# Altium schematic sheet SAM_E54_Xplained_Pro_triple_input_power_supply_HSW.SchDoc: Power supply
size A3; Organization: Microchip Norway; Address1: Vestre Rosten 79; Address2: N-7075 TILLER; Address3: NORWAY; DocumentNumber: A09-2748; Revision: 5; SheetNumber: 2; SheetTotal: 13; DrawnBy: Microchip Norway; Engineer: HN; PageSetup: Record=PageOptions|CenterHorizontal=True|CenterVertical=True|PrintScale=1.01|XCorrection=1.00|YCorrection=1.00|PrintKind=1|BorderSize=5000000|LeftOffset=0|BottomOffset=0|Orientation=2|PaperLength=1000|PaperWidth=1000|Scale=100|PaperSource=7|PrintQuality=-4|MediaType=1|DitherType=10|PaperKind=A3 (297 x 420 mm)|PrintScaleMode=1; ProjectTitle: SAM E54 Xplained Pro; PCBNumber: A08-2643; PCBRevision: 3; ProjectName: SAM E54 Xplained Pro
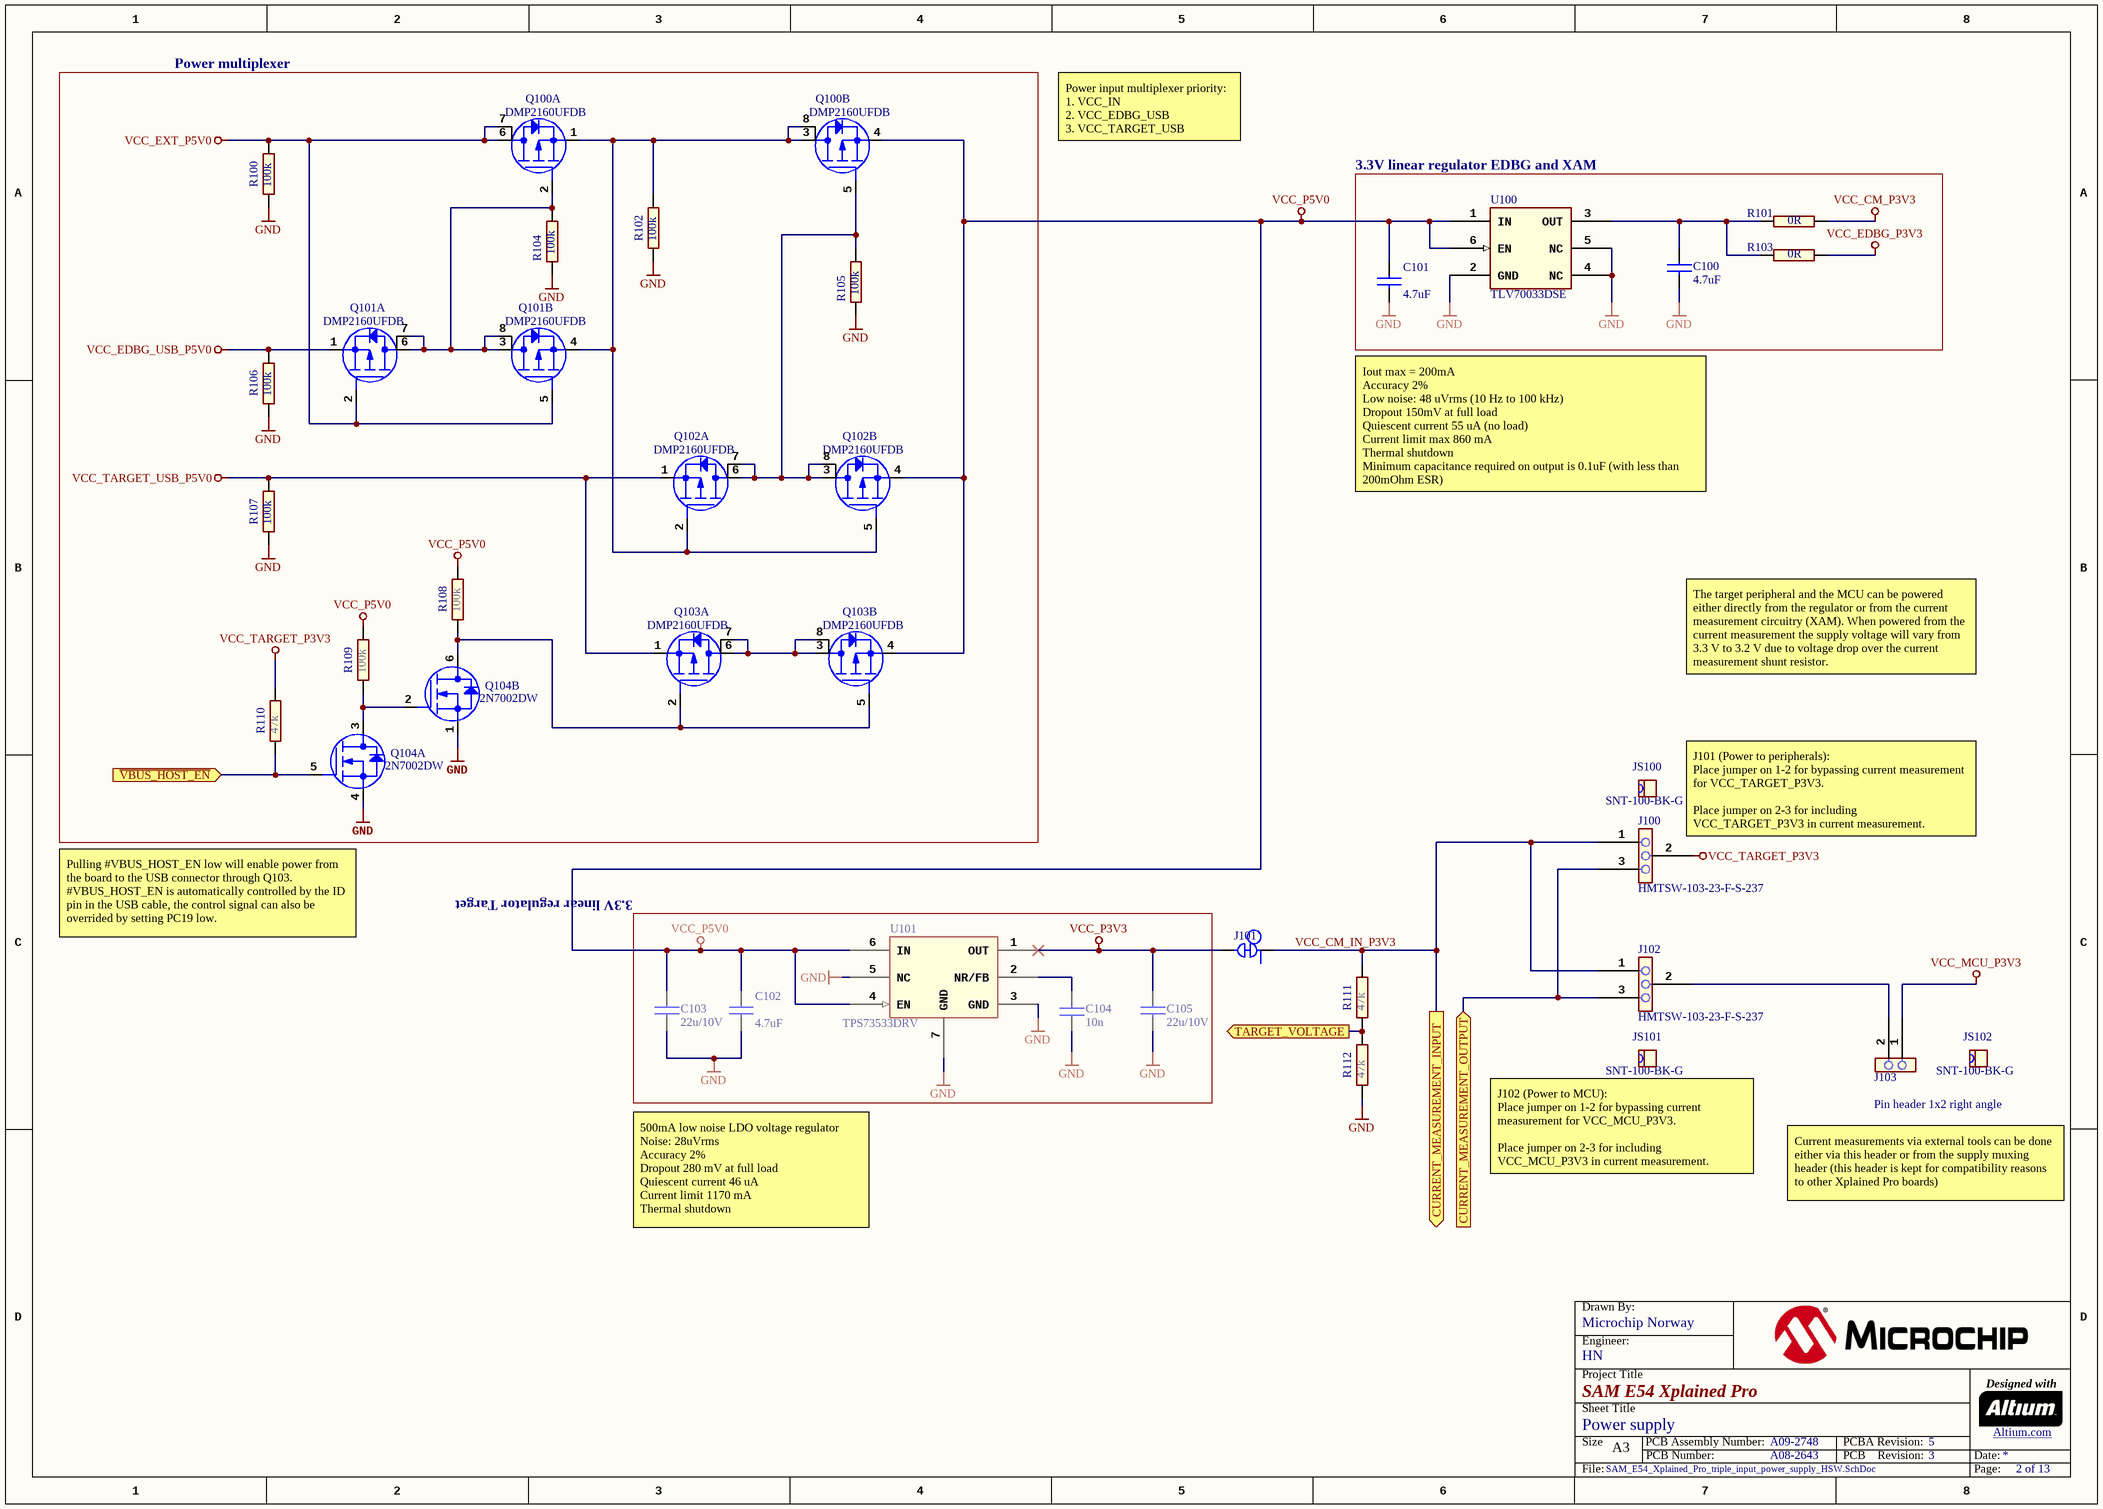
[diagram p0: SAM_E54_Xplained_Pro_triple_input_power_supply_HSW.SchDoc]

## Parts
C100  value 4.7uF  [AP1-00117]
C101  value 4.7uF  [AP1-00117]
C102  value 4.7uF  [AP1-00117]
C103  value 22u/10V  [AP1-00117]
C104  value 10n  [AP1-00053]
C105  value 22u/10V  [AP1-00117]
J100  value HMTSW-103-23-F-S-237  [AP8-00745]
J101  (no value)  [AP9-00044]  (net tie, no BOM)
J102  value HMTSW-103-23-F-S-237  [AP8-00745]
J103  value Pin header 1x2 right angle  [AP8-00367]
JS100  value SNT-100-BK-G  [AP8-00525]
JS101  value SNT-100-BK-G  [AP8-00525]
JS102  value SNT-100-BK-G  [AP8-00525]
Q100  value DMP2160UFDB  [AP5-00047]  (parts A,B of 2)
Q101  value DMP2160UFDB  [AP5-00047]  (parts A,B of 2)
Q102  value DMP2160UFDB  [AP5-00047]  (parts A,B of 2)
Q103  value DMP2160UFDB  [AP5-00047]  (parts A,B of 2)
Q104  value 2N7002DW  [AP5-00001]  (parts A,B of 2)
R100  value 100k  [AP2-00011]
R101  value 0R  [AP2-00011]
R102  value 100k  [AP2-00011]
R103  value 0R  [AP2-00011]
R104  value 100k  [AP2-00011]
R105  value 100k  [AP2-00011]
R106  value 100k  [AP2-00011]
R107  value 100k  [AP2-00011]
R108  value 100k  [AP2-00011]
R109  value 100k  [AP2-00011]
R110  value 47k  [AP2-00011]
R111  value 47k  [AP2-00011]
R112  value 47k  [AP2-00011]
U100  value TLV70033DSE  [AP6-00262]
U101  value TPS73533DRV  [AP6-00162]

## Blocks framed on the sheet
Power multiplexer: Q100-Q104 R100 R102 R104-R110
3.3V linear regulator EDBG and XAM: C100 C101 R101 R103 U100
3.3V linear regulator Target: C102-C105 U101

## Ports
CURRENT_MEASUREMENT_INPUT (out), CURRENT_MEASUREMENT_OUTPUT (in), TARGET_VOLTAGE (out), ~{VBUS_HOST_EN} (in)

## Nets
GND: C100.2 C101.2 C102.2 C103.2 C104.1 C105.2 Q104.1(S2) Q104.4(S1) R100.1 R102.1 R104.2 R105.1 R106.1 R107.1 R112.1 U100.2(GND) U100.4(NC) U100.5(NC) U101.3(GND) U101.5(NC) U101.7(GND)
VCC_CM_P3V3: R101.1
VCC_EDBG_P3V3: R103.1
VCC_EDBG_USB_P5V0: Q101.1(S1) R106.2
VCC_EXT_P5V0: Q100.6(D1) Q100.7(D1_PAD) Q101.2(G1) Q101.5(G2) R100.2
VCC_MCU_P3V3: J103.1
VCC_P3V3: C105.1 J101.2 U101.1(OUT)
VCC_P5V0: C101.1 C102.1 C103.1 Q100.4(S2) Q102.4(S2) Q103.4(S2) R108.2 R109.2 U100.1(IN) U100.6(EN) U101.4(EN) U101.6(IN)
VCC_TARGET_P3V3: J100.2 R110.2
VCC_TARGET_USB_P5V0: Q102.1(S1) Q103.1(S1) R107.2
CURRENT_MEASUREMENT_OUTPUT: J100.3 J102.3 ; port CURRENT_MEASUREMENT_OUTPUT
TARGET_VOLTAGE: R111.1 R112.2 ; port TARGET_VOLTAGE
~{VBUS_HOST_EN}: Q104.5(G1) R110.1 ; port ~{VBUS_HOST_EN}
VCC_CM_IN_P3V3: J100.1 J101.1 J102.1 R111.2 ; port CURRENT_MEASUREMENT_INPUT
NetC100_1: C100.1 R101.2 R103.2 U100.3(OUT)
NetC104_2: C104.2 U101.2(NR/FB)
NetJ102_2: J102.2 J103.2
NetQ100_1: Q100.1(S1) Q100.3(D2) Q100.8(D2_PAD) Q101.4(S2) Q102.2(G1) Q102.5(G2) R102.2
NetQ100_2: Q100.2(G1) Q101.3(D2) Q101.6(D1) Q101.7(D1_PAD) Q101.8(D2_PAD) R104.1
NetQ100_5: Q100.5(G2) Q102.3(D2) Q102.6(D1) Q102.7(D1_PAD) Q102.8(D2_PAD) R105.2
NetQ103_2: Q103.2(G1) Q103.5(G2) Q104.6(D2) R108.1
NetQ103_3: Q103.3(D2) Q103.6(D1) Q103.7(D1_PAD) Q103.8(D2_PAD)
NetQ104_2: Q104.2(G2) Q104.3(D1) R109.1

## Notes on the sheet
- Power input multiplexer priority:
  1. VCC_IN
  2. VCC_EDBG_USB
  3. VCC_TARGET_USB
- Iout max = 200mA
  Accuracy 2%
  Low noise: 48 uVrms (10 Hz to 100 kHz)
  Dropout 150mV at full load
  Quiescent current 55 uA (no load)
  Current limit max 860 mA
  Thermal shutdown
  Minimum capacitance required on output is 0.1uF (with less than 200mOhm ESR)
- The target peripheral and the MCU can be powered either directly from the regulator or from the current measurement circuitry (XAM). When powered from the current measurement the supply voltage will vary from 3.3 V to 3.2 V due to voltage drop over the current measurement shunt resistor.
- J101 (Power to peripherals):
  Place jumper on 1-2 for bypassing current measurement for VCC_TARGET_P3V3.
  Place jumper on 2-3 for including VCC_TARGET_P3V3 in current measurement.
- Pulling #VBUS_HOST_EN low will enable power from the board to the USB connector through Q103.
  #VBUS_HOST_EN is automatically controlled by the ID pin in the USB cable, the control signal can also be overrided by setting PC19 low.
- (near JS101) J102 (Power to MCU):
  Place jumper on 1-2 for bypassing current measurement for VCC_MCU_P3V3.
  Place jumper on 2-3 for including VCC_MCU_P3V3 in current measurement.
- 500mA low noise LDO voltage regulator
  Noise: 28uVrms
  Accuracy 2%
  Dropout 280 mV at full load
  Quiescent current 46 uA
  Current limit 1170 mA
  Thermal shutdown
- Current measurements via external tools can be done either via this header or from the supply muxing header (this header is kept for compatibility reasons to other Xplained Pro boards)
- Drawn By:
- Project Title
- Engineer:
- Designed with
- Sheet Title
- Size
- A3
- PCB Number:
- PCB Assembly Number:
- PCBA Revision:
- PCB    Revision:
- Date:
- Altium.com <http://go.altium.com/MicrochipLandingPage_Evaluation.html>
- File:
- Page:

## Library data of the parts
C100-C102 = A01-0377: Ceramic capacitor, SMD 0603, X5R, 10V, 10% (de31036); PartGroup: Capacitors,Ceramic,SMD 0603; Manufacturer: WALSIN Technology Corporation; MPN: 0603X475K100CT; TemperatureRange: -55 - +85 deg C; AN: A01-0377; Tolerance: 10%; Height: 0,800000011920929
C103 C105 = A01-0791: Ceramic capacitor, SMD 0603, X5R,10V, Â±20%; PartGroup: Capacitors,Ceramic,SMD 0603; Manufacturer: Murata; MPN: GRM188R61A226ME15D; AN: A01-0791; Tolerance: Â±20%
C104 = A01-0050: Ceramic capacitor, SMD 0402, X7R, 25V, +/-10%; PartGroup: Capacitors,Ceramic,SMD 0402; Manufacturer: YAGEO CORP; MPN: CC0402KRX7R8BB103; TemperatureRange: -55 - +125 deg C; AN: A01-0050; Tolerance: 25V, +/-10%; Height: 0,550000011920929
J100 J102 = A08-1799: 1x3 pin header, 2.54mm pitch, Pin-in-Paste THM, 1mm hole; PartGroup: Mechanical devices,Connectors,Pin headers; Manufacturer: SAMTEC; AN: A08-1799; Height: 6,09999990463257; MPN: HMTSW-103-23-F-S-237
J101 = A09-0783: Default closed SMD strap, 0603 size; PartGroup: Mechanical devices,PCB implemented components; Value: SMD-STRAP_0603_CLOSED; AN: A09-0783; Height: 0
J103 = A08-0764: 1x2 pin header, right angle, 2.54 mm pitch, through-hole; PartGroup: Mechanical devices,Connectors,Pin headers; Manufacturer: Pro-data International Corp; MPN: 2213R-2G; AN: A08-0764; Height: 2,53999996185303
JS100-JS102 = A08-0543: Jumper cap for 2.54mm pinheader; PartGroup: Mechanical devices,Mounting accessories,Other; Manufacturer: SAMTEC; AN: A08-0543; MPN: SNT-100-BK-G
Q100-Q103 = A05-0171: MOSFET 20V 3.8A DUAL P-CHAN, Rds 70 mOhms, Vgs 12V, Vds -20; PartGroup: Transistors,Power FET,SMD; Manufacturer: Diodes Incorporated; MPN: DMP2160UFDB-7; TemperatureRange: -55 C to +150 C; AN: A05-0171; Height: 0,605000019073486
Q104 = A05-0051: Dual N-Channel MOSFET, 60V, 115mA cont,RDS(ON) < 7.5 Ohm @50mA@5V, SOT-363; PartGroup: Transistors,Small signal FET,SMD; Manufacturer: Fairchild; TemperatureRange: -65 to 150 deg C; AN: A05-0051; Height: 1,10000002384186; MPN: 2N7002DW
R100 R102 R104-R109 = A02-0260: Thick film resistor, SMD 0402, 1/16W, 1%; PartGroup: Resistors,SMD,0402 1%; Manufacturer: ASJ; MPN: CR10-1003-FK; TemperatureRange: -55ï¿½ to +125ï¿½C; AN: A02-0260; Tolerance: 1 %; Height: 0,349999994039536
R101 R103 = A02-0163: RES 0.0 OHM 1/16W 0402 SMD; PartGroup: Resistors,SMD,0402 1%; Manufacturer: (n/a); MPN: RMCF0402ZT0R00; Tolerance: 1 %; TemperatureRange: -55 - +125 deg C; AN: A02-0163; Height: 0,349999994039536
R110-R112 = A02-0252: Thick film resistor, SMD 0402, 1/16W, 1%; PartGroup: Resistors,SMD,0402 1%; Manufacturer: KOA; MPN: RK73H1ETTP4702F; TemperatureRange: -55 - +125 deg C; AN: A02-0252; Tolerance: 1 %; Height: 0,349999994039536
U100 = A06-0719: LDO, 200 mA, Iq=31 uA, Vdo=250mV, Vout=3.3V, VIN= 2 V to 5.5V, SON-6 package; PartGroup: Integrated Circuits,Regulators,Linear; Manufacturer: Texas Instruments; AN: A06-0719; Height: 0,800000011920929; MPN: TLV70033DSE
U101 = A06-1135: Low noise LDO, 500 mA, Vout=3.3V, 2% accuracy, IQ=46uA, noise=28uVrms, VIN= 2.7V to 6.5V, Vdo=280mV,stable with low ESR capacitor; PartGroup: Integrated Circuits,Regulators,Linear; Manufacturer: Texas Instruments; AN: A06-1135; Height: 0,75; MPN: TPS73533DRV